# Altium schematic sheet 海关全向本体电路板V3_扩展RS485通信.SchDoc
size A4
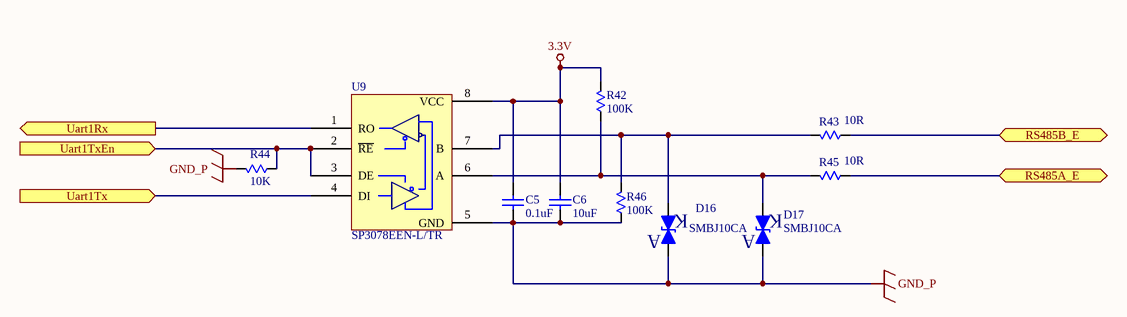
[diagram p0: 海关全向本体电路板V3_扩展RS485通信.SchDoc]

## Parts
C5  0.1uF  [C0603-S]
C6  10uF  [C0603-S]
D16  SMBJ10CA  [SMB-S]
D17  SMBJ10CA  [SMB-S]
R42  100K  [R0603-S]
R43  10R  [R1206-S]
R44  10K  [R0603-S]
R45  10R  [R1206-S]
R46  100K  [R0603-S]
U9  SP3078EEN-L/TR  [SO8-150]

## Ports
RS485A_E (bidir), RS485B_E (bidir), Uart1Rx (out), Uart1Tx (in), Uart1TxEn (in)

## Nets
3.3V: C5.2 C6.2 R42.2 U9.8(VCC)
GND_P: C5.1 C6.1 D16.1(A) D17.1(A) R44.2 R46.1 U9.5(GND)
RS485A_E: R45.1 ; port RS485A_E
RS485B_E: R43.1 ; port RS485B_E
Uart1Rx: U9.1(RO) ; port Uart1Rx
Uart1Tx: U9.4(DI) ; port Uart1Tx
Uart1TxEn: R44.1 U9.2(~{RE}) U9.3(DE) ; port Uart1TxEn
NetD16_2: D16.2(K) R43.2 R46.2 U9.7(B)
NetD17_2: D17.2(K) R42.1 R45.2 U9.6(A)

## Library data of the parts
C5 C6 = CAP: Published: 8-Jun-2000; LatestRevisionDate: 17-Jul-2002; LatestRevisionNote: Re-released for DXP Platform.; PackageReference: RAD-0.3; Publisher: Altium Limited
  C5: Value: 0.1uF
  C6: Value: 10uF
D16 D17 = BS0300N
R42-R46 = RES: Resistor; Published: 8-Jun-2000; LatestRevisionDate: 17-Jul-2002; LatestRevisionNote: Re-released for DXP Platform.; PackageReference: AXIAL-0.3; Publisher: Altium Limited
  R42 R46: Value: 100K
  R43 R45: Value: 10R
  R44: Value: 10K
U9 = SP3078EEN